# Altium schematic sheet STM32F103.SchDoc
size A3; SheetNumber: 7; SheetTotal: 16
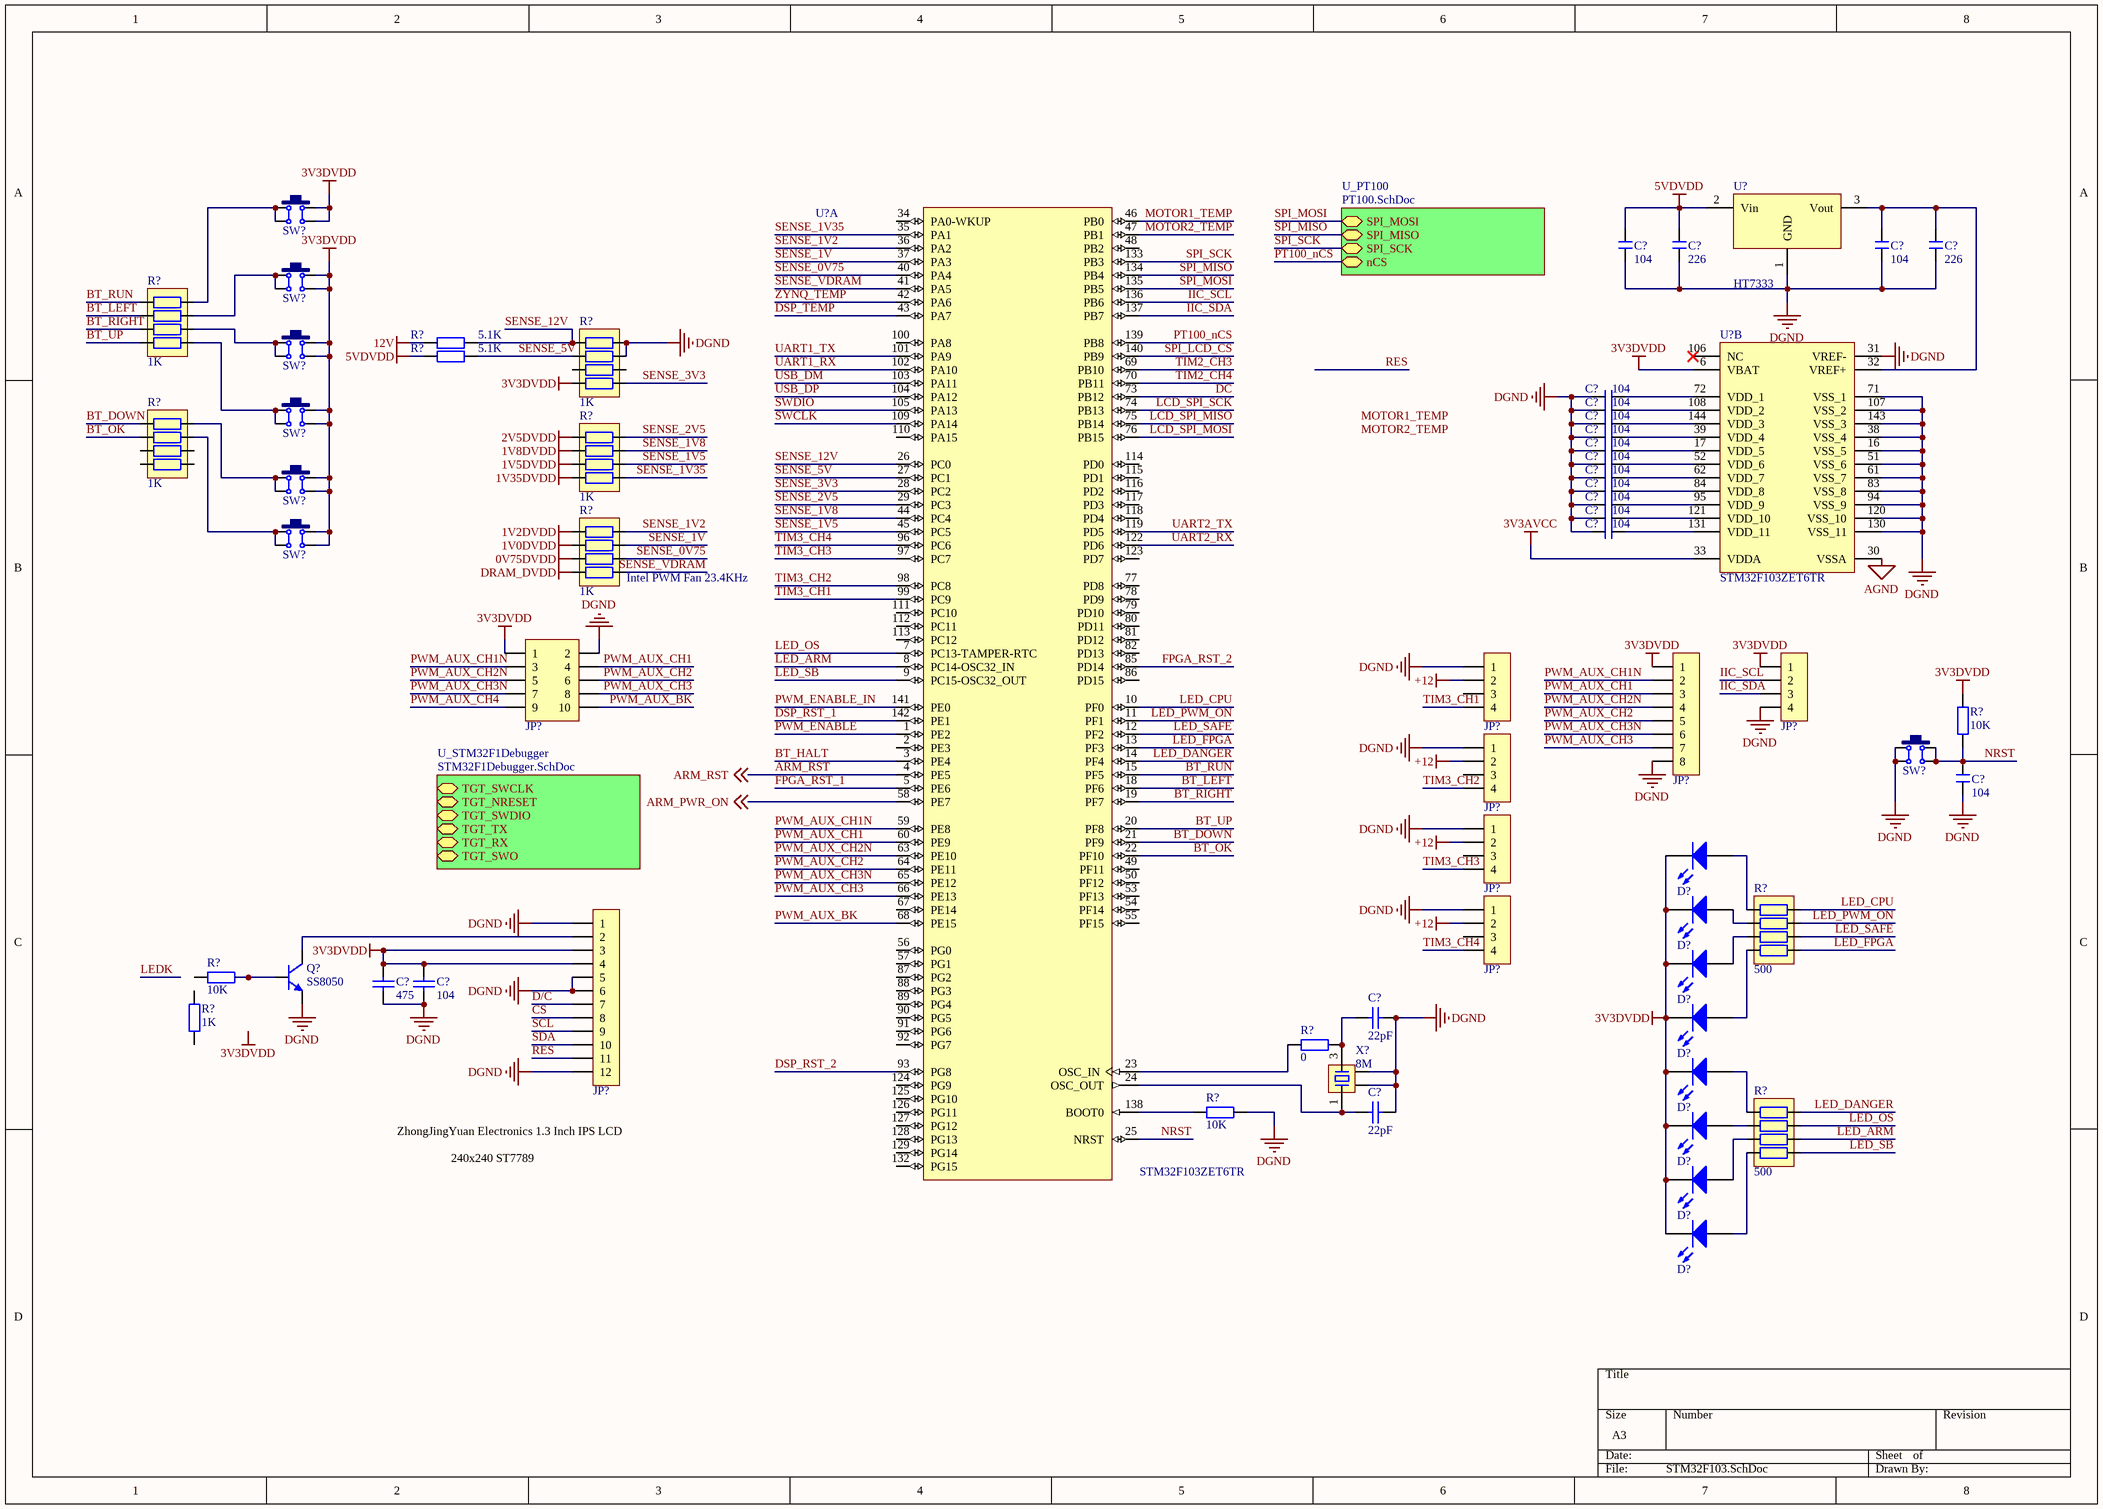
[diagram p0: STM32F103.SchDoc]

## Parts
(Parts that share a designator on the sheet are numbered #1, #2 ... from top to bottom, then left to right.)
C?#1  104  [C 0603_L]
C?#2  226  [C 0603_L]
C?#3  104  [C 0603_L]
C?#4  226  [C 0603_L]
C?#5  104  [C 0603_L]
C?#6  104  [C 0603_L]
C?#7  104  [C 0603_L]
C?#8  104  [C 0603_L]
C?#9  104  [C 0603_L]
C?#10  104  [C 0603_L]
C?#11  104  [C 0603_L]
C?#12  104  [C 0603_L]
C?#13  104  [C 0603_L]
C?#14  104  [C 0603_L]
C?#15  104  [C 0603_L]
C?#16  104  [C 0603_L]
C?#17  475  [0603_C]
C?#18  104  [0603_C]
C?#19  22pF  [0603_C]
C?#20  22pF  [0603_C]
D?#1  LED  [LED 0603W]  (value not drawn)
D?#2  LED  [LED 0603W]  (value not drawn)
D?#3  LED  [LED 0603W]  (value not drawn)
D?#4  LED  [LED 0603W]  (value not drawn)
D?#5  LED  [LED 0603W]  (value not drawn)
D?#6  LED  [LED 0603W]  (value not drawn)
D?#7  LED  [LED 0603W]  (value not drawn)
D?#8  LED  [LED 0603W]  (value not drawn)
JP?#1  Header 5X2  [IDC2.54-LI-2x5P]  (value not drawn)
JP?#2  HDR-1X4  [KF2510-LI-4P]  (value not drawn)
JP?#3  HDR-1X8  [XH2.54-WI-8P]  (value not drawn)
JP?#4  HDR-1X4  [XH2.54-WI-4P]  (value not drawn)
JP?#5  HDR-1X4  [KF2510-LI-4P]  (value not drawn)
JP?#6  HDR-1X4  [KF2510-LI-4P]  (value not drawn)
JP?#7  HDR-1X4  [KF2510-LI-4P]  (value not drawn)
JP?#8  HDR-1X12  [FPC0.5 2H-WS-12P]  (value not drawn)
Q?  SS8050  [SOT23-3N]
R?#1  1K  [RCA-8P4R-0603]
R?#2  5.1K  [R 0603_L]
R?#3  1K  [RCA-8P4R-0603]
R?#4  5.1K  [R 0603_L]
R?#5  1K  [RCA-8P4R-0603]
R?#6  1K  [RCA-8P4R-0603]
R?#7  1K  [RCA-8P4R-0603]
R?#8  10K  [R 0603_L]
R?#9  500  [RCA-8P4R-0603]
R?#10  10K  [R 0603_L]
R?#11  1K  [R 0603_L]
R?#12  0  [R 0603_L]
R?#13  10K  [R 0603_L]
R?#14  500  [RCA-8P4R-0603]
SW?#1  6x6x5  [TSW SMD-6*6*4.3]  (value not drawn)
SW?#2  6x6x5  [TSW SMD-6*6*4.3]  (value not drawn)
SW?#3  6x6x5  [TSW SMD-6*6*4.3]  (value not drawn)
SW?#4  6x6x5  [TSW SMD-6*6*4.3]  (value not drawn)
SW?#5  6x6x5  [TSW SMD-6*6*4.3]  (value not drawn)
SW?#6  6x6x5  [TSW SMD-6*6*4.3]  (value not drawn)
SW?#7  6x6x5  [TSW SMD-6*6*4.3]  (value not drawn)
U?#1  HT7333  [SOT89_N]
U?#2  STM32F103ZET6TR  [LQFP144_N]  (part A of 2)
U?#3  STM32F103ZET6TR  [LQFP144_N]  (part B of 2)
X?  8M  [OSC 3225-4P]

## Sub-sheets
U_PT100 = PT100.SchDoc: SPI_MOSI (bidir), SPI_MISO (bidir), SPI_SCK (bidir), nCS (bidir)
U_STM32F1Debugger = STM32F1Debugger.SchDoc: TGT_SWCLK (bidir), TGT_NRESET (bidir), TGT_SWDIO (bidir), TGT_TX (bidir), TGT_RX (bidir), TGT_SWO (bidir)

## Nets
0V75DVDD: R?#7.6
1V0DVDD: R?#7.7
1V2DVDD: R?#7.8
1V5DVDD: R?#6.6
1V8DVDD: R?#6.7
1V35DVDD: R?#6.5
2V5DVDD: R?#6.8
3V3AVCC: U?#3.33(VDDA)
3V3DVDD: C?#17.2 C?#18.2 D?#1.2(K) D?#2.2(K) D?#3.2(K) D?#4.2(K) D?#5.2(K) D?#6.2(K) D?#7.2(K) D?#8.2(K) JP?#1.1 JP?#3.1 JP?#4.1 JP?#8.3 JP?#8.4 R?#3.5 R?#8.2 SW?#1.2 SW?#1.3 SW?#2.2 SW?#2.3 SW?#3.2 SW?#3.3 SW?#4.2 SW?#4.3 SW?#5.2 SW?#5.3 SW?#6.2 SW?#6.3 U?#3.6(VBAT)
5VDVDD: C?#1.2 C?#2.2 R?#4.1 U?#1.2(Vin)
12V: R?#2.1
+12: JP?#2.2 JP?#5.2 JP?#6.2 JP?#7.2
AGND: U?#3.30(VSSA)
DGND: C?#1.1 C?#2.1 C?#3.1 C?#4.1 C?#5.1 C?#6.1 C?#7.1 C?#8.1 C?#9.1 C?#10.1 C?#11.1 C?#12.1 C?#13.1 C?#14.1 C?#15.1 C?#16.1 C?#17.1 C?#18.1 C?#19.2 C?#20.2 JP?#1.2 JP?#2.1 JP?#3.8 JP?#4.4 JP?#5.1 JP?#6.1 JP?#7.1 JP?#8.1 JP?#8.5 JP?#8.6 JP?#8.12 Q?.2(E) R?#3.1 R?#3.2 R?#13.2 SW?#7.1 SW?#7.4 U?#1.1(GND) U?#3.16(VSS_5) U?#3.31(VREF-) U?#3.38(VSS_4) U?#3.51(VSS_6) U?#3.61(VSS_7) U?#3.71(VSS_1) U?#3.83(VSS_8) U?#3.94(VSS_9) U?#3.107(VSS_2) U?#3.120(VSS_10) U?#3.130(VSS_11) U?#3.143(VSS_3) X?.2 X?.4
DRAM_DVDD: R?#7.5
ARM_PWR_ON: U?#2.58(PE7) ; off-sheet ARM_PWR_ON
ARM_RST: U?#2.4(PE5) ; off-sheet ARM_RST
BT_DOWN: R?#5.8 U?#2.21(PF9)
BT_HALT: U?#2.3(PE4)
BT_LEFT: R?#1.7 U?#2.18(PF6)
BT_OK: R?#5.7 U?#2.22(PF10)
BT_RIGHT: R?#1.6 U?#2.19(PF7)
BT_RUN: R?#1.8 U?#2.15(PF5)
BT_UP: R?#1.5 U?#2.20(PF8)
CS: JP?#8.8
D/C: JP?#8.7
DC: U?#2.73(PB12)
DSP_RST_1: U?#2.142(PE1)
DSP_RST_2: U?#2.93(PG8)
DSP_TEMP: U?#2.43(PA7)
FPGA_RST_1: U?#2.5(PE6)
FPGA_RST_2: U?#2.85(PD14)
IIC_SCL: JP?#4.2 U?#2.136(PB6)
IIC_SDA: JP?#4.3 U?#2.137(PB7)
LCD_SPI_MISO: U?#2.75(PB14)
LCD_SPI_MOSI: U?#2.76(PB15)
LCD_SPI_SCK: U?#2.74(PB13)
LED_ARM: R?#14.3 U?#2.8(PC14-OSC32_IN)
LED_CPU: R?#9.1 U?#2.10(PF0)
LED_DANGER: R?#14.1 U?#2.14(PF4)
LED_FPGA: R?#9.4 U?#2.13(PF3)
LED_OS: R?#14.2 U?#2.7(PC13-TAMPER-RTC)
LED_PWM_ON: R?#9.2 U?#2.11(PF1)
LED_SAFE: R?#9.3 U?#2.12(PF2)
LED_SB: R?#14.4 U?#2.9(PC15-OSC32_OUT)
MOTOR1_TEMP: U?#2.46(PB0)
MOTOR2_TEMP: U?#2.47(PB1)
NRST: C?#16.2 R?#8.1 SW?#7.2 SW?#7.3 U?#2.25(NRST)
PT100_nCS: U?#2.139(PB8) ; sheet U_PT100/nCS
PWM_AUX_BK: JP?#1.10 U?#2.68(PE15)
PWM_AUX_CH1: JP?#1.4 JP?#3.3 U?#2.60(PE9)
PWM_AUX_CH1N: JP?#1.3 JP?#3.2 U?#2.59(PE8)
PWM_AUX_CH2: JP?#1.6 JP?#3.5 U?#2.64(PE11)
PWM_AUX_CH2N: JP?#1.5 JP?#3.4 U?#2.63(PE10)
PWM_AUX_CH3: JP?#1.8 JP?#3.7 U?#2.66(PE13)
PWM_AUX_CH3N: JP?#1.7 JP?#3.6 U?#2.65(PE12)
PWM_AUX_CH4: JP?#1.9
PWM_ENABLE: U?#2.1(PE2)
PWM_ENABLE_IN: U?#2.141(PE0)
RES: JP?#8.11
SCL: JP?#8.9
SDA: JP?#8.10
SENSE_0V75: R?#7.3 U?#2.40(PA4)
SENSE_1V: R?#7.2 U?#2.37(PA3)
SENSE_1V2: R?#7.1 U?#2.36(PA2)
SENSE_1V5: R?#6.3 U?#2.45(PC5)
SENSE_1V8: R?#6.2 U?#2.44(PC4)
SENSE_1V35: R?#6.4 U?#2.35(PA1)
SENSE_2V5: R?#6.1 U?#2.29(PC3)
SENSE_3V3: R?#3.4 U?#2.28(PC2)
SENSE_5V: R?#3.7 R?#4.2 U?#2.27(PC1)
SENSE_12V: R?#2.2 R?#3.8 U?#2.26(PC0)
SENSE_VDRAM: R?#7.4 U?#2.41(PA5)
SPI_LCD_CS: U?#2.140(PB9)
SPI_MISO: U?#2.134(PB4) ; sheet U_PT100/SPI_MISO
SPI_MOSI: U?#2.135(PB5) ; sheet U_PT100/SPI_MOSI
SPI_SCK: U?#2.133(PB3) ; sheet U_PT100/SPI_SCK
SWCLK: U?#2.109(PA14)
SWDIO: U?#2.105(PA13)
TIM2_CH3: U?#2.69(PB10)
TIM2_CH4: U?#2.70(PB11)
TIM3_CH1: JP?#2.4 U?#2.99(PC9)
TIM3_CH2: JP?#5.4 U?#2.98(PC8)
TIM3_CH3: JP?#6.4 U?#2.97(PC7)
TIM3_CH4: JP?#7.4 U?#2.96(PC6)
UART1_RX: U?#2.102(PA10)
UART1_TX: U?#2.101(PA9)
UART2_RX: U?#2.122(PD6)
UART2_TX: U?#2.119(PD5)
USB_DM: U?#2.103(PA11)
USB_DP: U?#2.104(PA12)
ZYNQ_TEMP: U?#2.42(PA6)
NetC?#3_2: C?#3.2 C?#4.2 U?#1.3(Vout) U?#3.32(VREF+)
NetC?#5_2: C?#5.2 U?#3.72(VDD_1)
NetC?#6_2: C?#6.2 U?#3.108(VDD_2)
NetC?#7_2: C?#7.2 U?#3.144(VDD_3)
NetC?#8_2: C?#8.2 U?#3.39(VDD_4)
NetC?#9_2: C?#9.2 U?#3.17(VDD_5)
NetC?#10_2: C?#10.2 U?#3.52(VDD_6)
NetC?#11_2: C?#11.2 U?#3.62(VDD_7)
NetC?#12_2: C?#12.2 U?#3.84(VDD_8)
NetC?#13_2: C?#13.2 U?#3.95(VDD_9)
NetC?#14_2: C?#14.2 U?#3.121(VDD_10)
NetC?#15_2: C?#15.2 U?#3.131(VDD_11)
NetC?#19_1: C?#19.1 R?#12.1 X?.3
NetC?#20_1: C?#20.1 U?#2.24(OSC_OUT) X?.1
NetD?#1_1: D?#1.1(A) R?#9.8
NetD?#2_1: D?#2.1(A) R?#9.7
NetD?#3_1: D?#3.1(A) R?#9.6
NetD?#4_1: D?#4.1(A) R?#9.5
NetD?#5_1: D?#5.1(A) R?#14.8
NetD?#6_1: D?#6.1(A) R?#14.7
NetD?#7_1: D?#7.1(A) R?#14.6
NetD?#8_1: D?#8.1(A) R?#14.5
NetJP?#8_2: JP?#8.2 Q?.3(C)
NetQ?_1: Q?.1(B) R?#10.1
NetR?#1_1: R?#1.1 SW?#1.1 SW?#1.4
NetR?#1_2: R?#1.2 SW?#2.1 SW?#2.4
NetR?#1_3: R?#1.3 SW?#3.1 SW?#3.4
NetR?#1_4: R?#1.4 SW?#4.1 SW?#4.4
NetR?#5_1: R?#5.1 SW?#5.1 SW?#5.4
NetR?#5_2: R?#5.2 SW?#6.1 SW?#6.4
NetR?#12_2: R?#12.2 U?#2.23(OSC_IN)
NetR?#13_1: R?#13.1 U?#2.138(BOOT0)

Not connected (* = marked no-connect by the designer): JP?#2 3; JP?#5 3; JP?#6 3; JP?#7 3; R?#3 3 6; R?#5 3 4 5 6; R?#10 2; R?#11 1 2; U?#2 2(PE3) 34(PA0-WKUP) 48(PB2) 49(PF11) 50(PF12) 53(PF13) 54(PF14) 55(PF15) 56(PG0) 57(PG1) 67(PE14) 77(PD8) 78(PD9) 79(PD10) 80(PD11) 81(PD12) 82(PD13) 86(PD15) 87(PG2) 88(PG3) 89(PG4) 90(PG5) 91(PG6) 92(PG7) 100(PA8) 110(PA15) 111(PC10) 112(PC11) 113(PC12) 114(PD0) 115(PD1) 116(PD2) 117(PD3) 118(PD4) 123(PD7) 124(PG9) 125(PG10) 126(PG11) 127(PG12) 128(PG13) 129(PG14) 132(PG15); U?#3 106(NC)*

## Notes on the sheet
- (near R?#7) Intel PWM Fan 23.4KHz
- (near JP?#8) ZhongJingYuan Electronics 1.3 Inch IPS LCD
- 240x240 ST7789
- Labels drawn without touching a wire or pin: 3V3DVDD, MOTOR1_TEMP, MOTOR2_TEMP

## Library data of the parts
C?#1-C?#16 = C: 贴片电容; BOM名称: 无极性贴片电容; 淘宝ID: 封装库来自淘宝 ID：黄晶宝石; 联系售后，技术支持: https://shop463601444.taobao.com; 唯一出售店铺网址: https://shop463601444.taobao.com
C?#17-C?#20 = Cap: Capacitor; Published: 8-Jun-2000; LatestRevisionDate: 17-Jul-2002; LatestRevisionNote: Re-released for DXP Platform.; PackageReference: RAD-0.3; Publisher: Altium Limited
  C?#17: Value: 475
  C?#18: Value: 104
  C?#19 C?#20: Value: 22pF
D?#1-D?#8 = LED: 发光二极管; 技术支持，联系售后: https://shop463601444.taobao.com
JP?#1 = Header 5X2: 5*2P接插件; 版权归属: 封装库来自淘宝 ID：黄晶宝石; BOM名称: 5*2P接插件; 学习资源: https://shop463601444.taobao.com
JP?#2 JP?#4-JP?#7 = Header 4: 4P接插件; 版权归属: 封装库来自淘宝 ID：黄晶宝石; BOM名称: 4P接插件; 学习资源: https://shop463601444.taobao.com
JP?#3 = Header 8: 8P接插件; 版权归属: 封装库来自淘宝 ID：黄晶宝石; BOM名称: 8P接插件; 学习资源: https://shop463601444.taobao.com
JP?#8 = Header 12: 12P接插件; 版权归属: 封装库来自淘宝卖家 ID：黄晶宝石; BOM名称: 12P接插件; 学习资源: https://shop463601444.taobao.com
Q? = 8050-SMD: 高频放大-NPN型; 版权归属: 封装库来自淘宝 ID：黄晶宝石; 属性: 40V 1.5A 1W 100MHZ; BOM名称: 高频放大-NPN型; 联系售后: https://shop463601444.taobao.com
R?#1 R?#3 R?#5-R?#7 R?#9 R?#14 = R-8P4R: 贴片排阻; BOM名称: 贴片网络排阻; 版权归属: 封装库来自淘宝 ID：黄晶宝石; 联系售后: https://shop463601444.taobao.com
R?#2 R?#4 R?#8 R?#10-R?#13 = R: 贴片电阻; 版权归属: 来自淘宝 ID：黄晶宝石; 封装库来自淘宝卖家 ID：黄晶宝石: 其他店铺购入均为盗版，不享受售后技术支持服务，请立即申请退款; BOM名称: 贴片电阻; 联系售后: https://shop463601444.taobao.com
SW?#1-SW?#7 = TSW SMD-6x6: 贴片6x6轻触开关; 版权归属: 封装库来自淘宝 ID：黄晶宝石; BOM名称: 贴片6x6轻触开关; 唯一出售店铺网址: https://shop463601444.taobao.com
U?#1 = HT7333: LDO线性稳压芯片
U?#2 U?#3 = STM32F103ZET6TR: STM32 ARM-based 32-bit MCU Performance Line with 512 kB Flash, 64 kB Internal RAM, -40 to +85癈 Temperature, 144-Pin LQFP, Tape and Reel; DatasheetVersion: rev8.0, Apr-2011; PackageVersion: 2011; PackageReference: LQFP144; PackageDescription: 144-Pin Thin Quad Flat Pack 0.5 mm Pitch; ComponentLink1Description: Manufacturer URL; ComponentLink1URL: http://www.st.com/; ComponentLink2Description: STM32F103 Datasheet; ComponentLink2URL: http://www.st.com/internet/com/TECHNICAL_RESOURCES/TECHNICAL_LITERATURE/DATASHEET/CD00191185.pdf; ComponentLink3Description: STM32 Family Web Page; ComponentLink3URL: www.st.com/stm32
X? = XTAL-4P: 4脚无源晶振; 版权归属: 封装库来自淘宝卖家 ID：黄晶宝石; BOM名称: 4脚无源晶振; 学习资源: https://shop463601444.taobao.com